# EasyEDA Pro project Aquarium_Temp_Monitor.eprj

# Schematic Schematic1
Board Name: Board1; Create Date: 2025-07-31; Page Name: P1; Project Name: Aquarium_Temp_Monitor; Schematic Name: Schematic1; Update Date: 2025-07-30; Company: EasyEDA.com; Page Size: A4; Version: V1.0
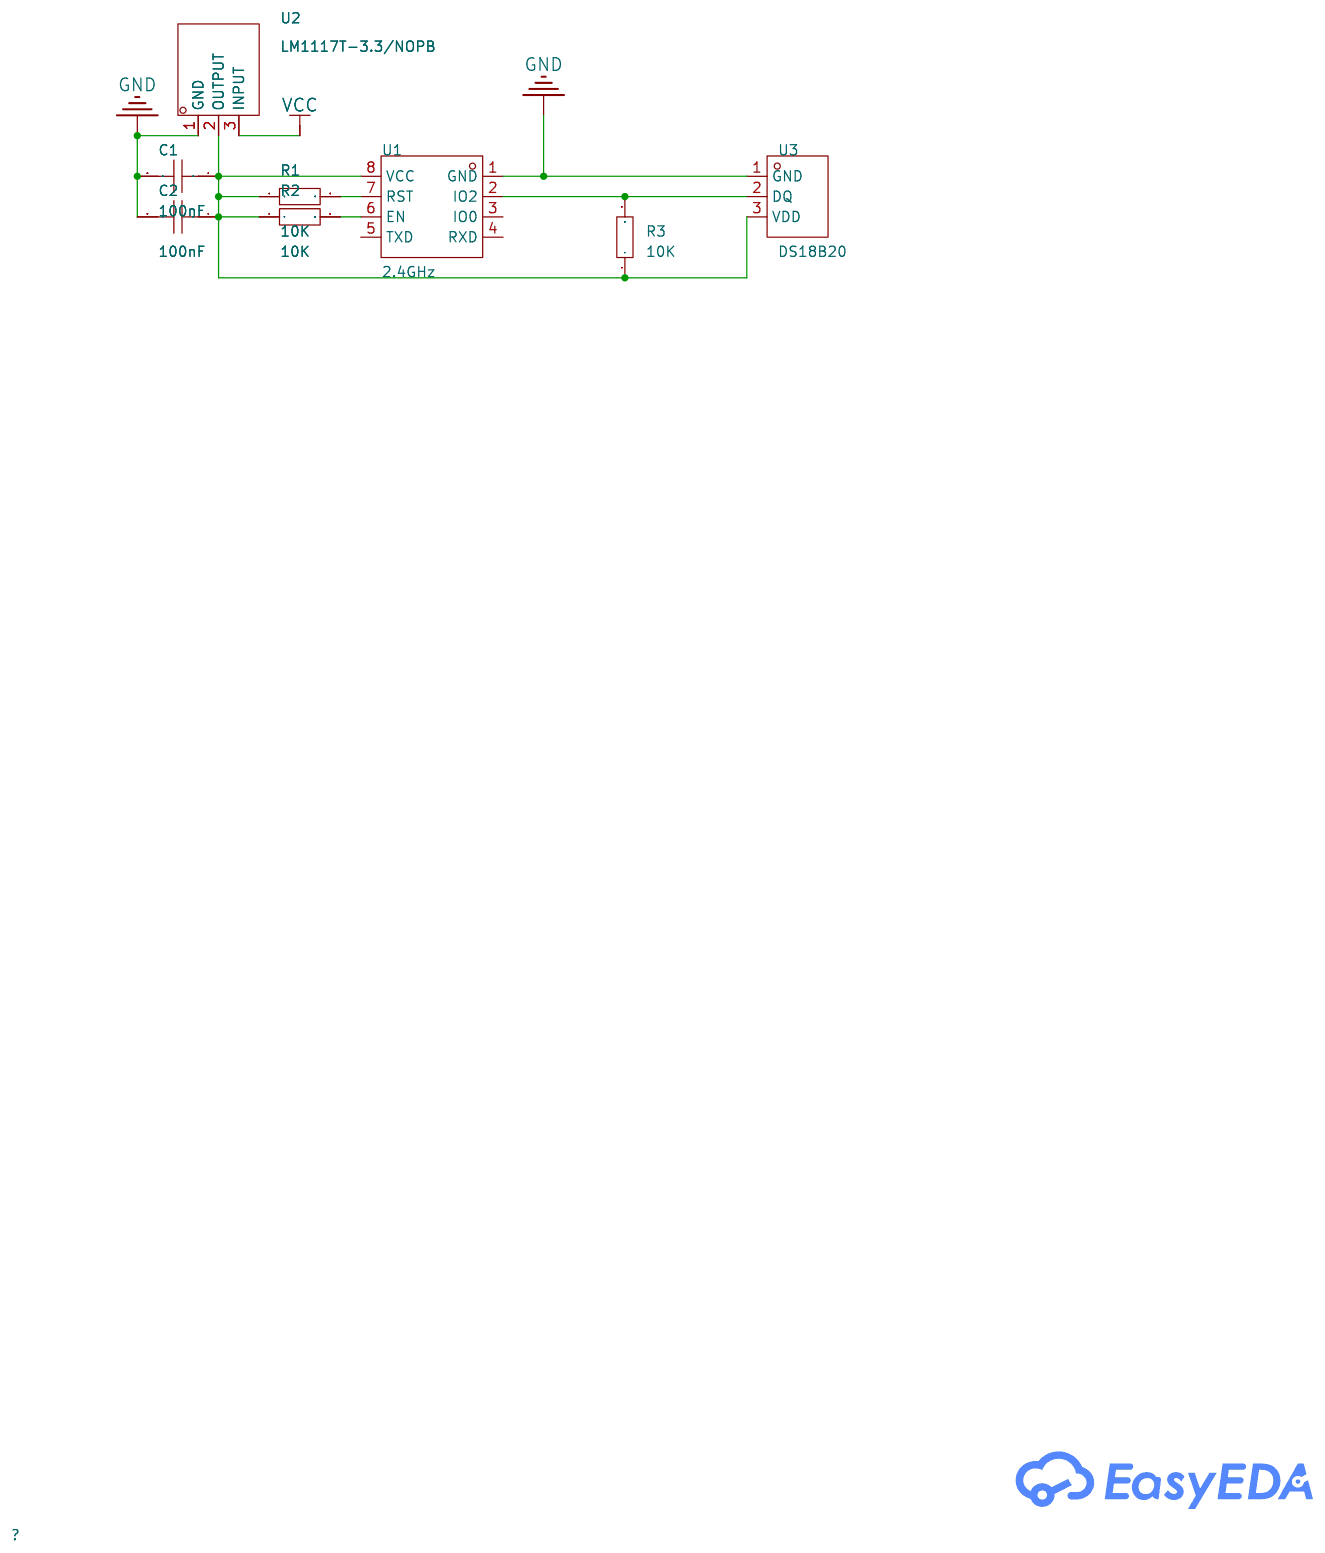
[diagram p0: schematic sheet]

## Parts
C1  100nF  [CAP-TH_L7.0-W4.5-P5.00-D0.5]
C2  100nF  [CAP-TH_L7.0-W4.5-P5.00-D0.5]
R1  10K  [RES-TH_BD2.0-L4.2-P8.20-D0.5]
R2  10K  [RES-TH_BD2.0-L4.2-P8.20-D0.5]
R3  10K  [RES-TH_BD2.0-L4.2-P8.20-D0.5]
U1  2.4GHz  [WIFIM-TH_8P-L24.7-W14.4-P2.54]
U2  LM1117T-3.3/NOPB  [TO-220-3_L10.0-W4.5-P2.54-L]
U3  DS18B20  [TO-92-3_L4.5-W3.5-P1.27-L]

## Library data of the parts
C1 C2 = CAP_0603: Supplier Footprint: 0603
R1-R3 = Res_0603: Supplier Footprint: 0603
U1 = ESP-01: LCSC Part Name: 体积超小的802.11b/g/nWi-FiSOC模块; Supplier Part: C503581; Manufacturer: Ai-Thinker(安信可); JLCPCB Part Class: Extended Part; Datasheet: https://atta.szlcsc.com/upload/public/pdf/source/20200407/C503581_BFDAA19F4B592DB0CEE4D61B6918C625.pdf; Supplier: LCSC; Utilized IC / Part: ESP8266 chip; Wireless Standard: 802.11b/g/n; Interface Type: UART; Output Power: 16dBm; Voltage - Supply: 3V~3.6V; Receive  Current: 20mA; Send  Current: 300mA; Sensitivity: -90dBm; Operating Temperature: -20℃~+85℃
U2 = LM1117T-3.3/NOPB: LCSC Part Name: 输入15V 输出3.3V 800mA; Supplier Part: C201726; Manufacturer: TI(德州仪器); Supplier Footprint: TO-220; JLCPCB Part Class: Extended Part; Datasheet: https://www.ti.com/cn/lit/gpn/lm1117; Supplier: LCSC; Maximum Input Voltage: 15V; Output Voltage: 3.3V; MAX Output Current: 800mA; Power Supply Rejection Ratio (PSRR): 75dB@(120Hz); Dropout Voltage: 1.2V@(800mA); standby current: 5mA; Operating Temperature: 0℃~+125℃; Output Polarity: Positive electrode; Number of Outputs: 1
U3 = DS18B20_C5451632: LCSC Part Name: 温度-10℃~70℃ 精度±0.4℃ 电压2.5V~5.5V; Supplier Part: C5451632; Manufacturer: HXY MOSFET(华轩阳电子); Supplier Footprint: TO-92; JLCPCB Part Class: Extended Part; Datasheet: https://atta.szlcsc.com/upload/public/pdf/source/20230427/F43BF9FBC8AD29BCFCC811AFA154CBDD.pdf; Supplier: LCSC; Tolerance: ±0.4℃; Voltage - Supply: 2.5V~5.5V

## Nets
GND: C1.2 C2.2 U1.1(GND) U2.1(GND) U3.1(GND)
VCC: U2.3(INPUT)
$1N378: C1.1 C2.1 R1.1 R2.1 R3.1 U1.8(VCC) U2.2(OUTPUT) U3.3(VDD)
$1N473: R3.2 U1.2(IO2) U3.2(DQ)
$1N565: R2.2 U1.6(EN)
$1N569: R1.2 U1.7(RST)

Not connected (* = marked no-connect by the designer): U1 3(IO0) 4(RXD) 5(TXD)

# Schematic Schematic1_1
Board Name: Board1_1; Create Date: 2025-07-31; Page Name: P1; Project Name: Aquarium_Temp_Monitor; Schematic Name: Schematic1_1; Update Date: 2025-07-31; Company: EasyEDA.com; Page Size: A4; Version: V1.0
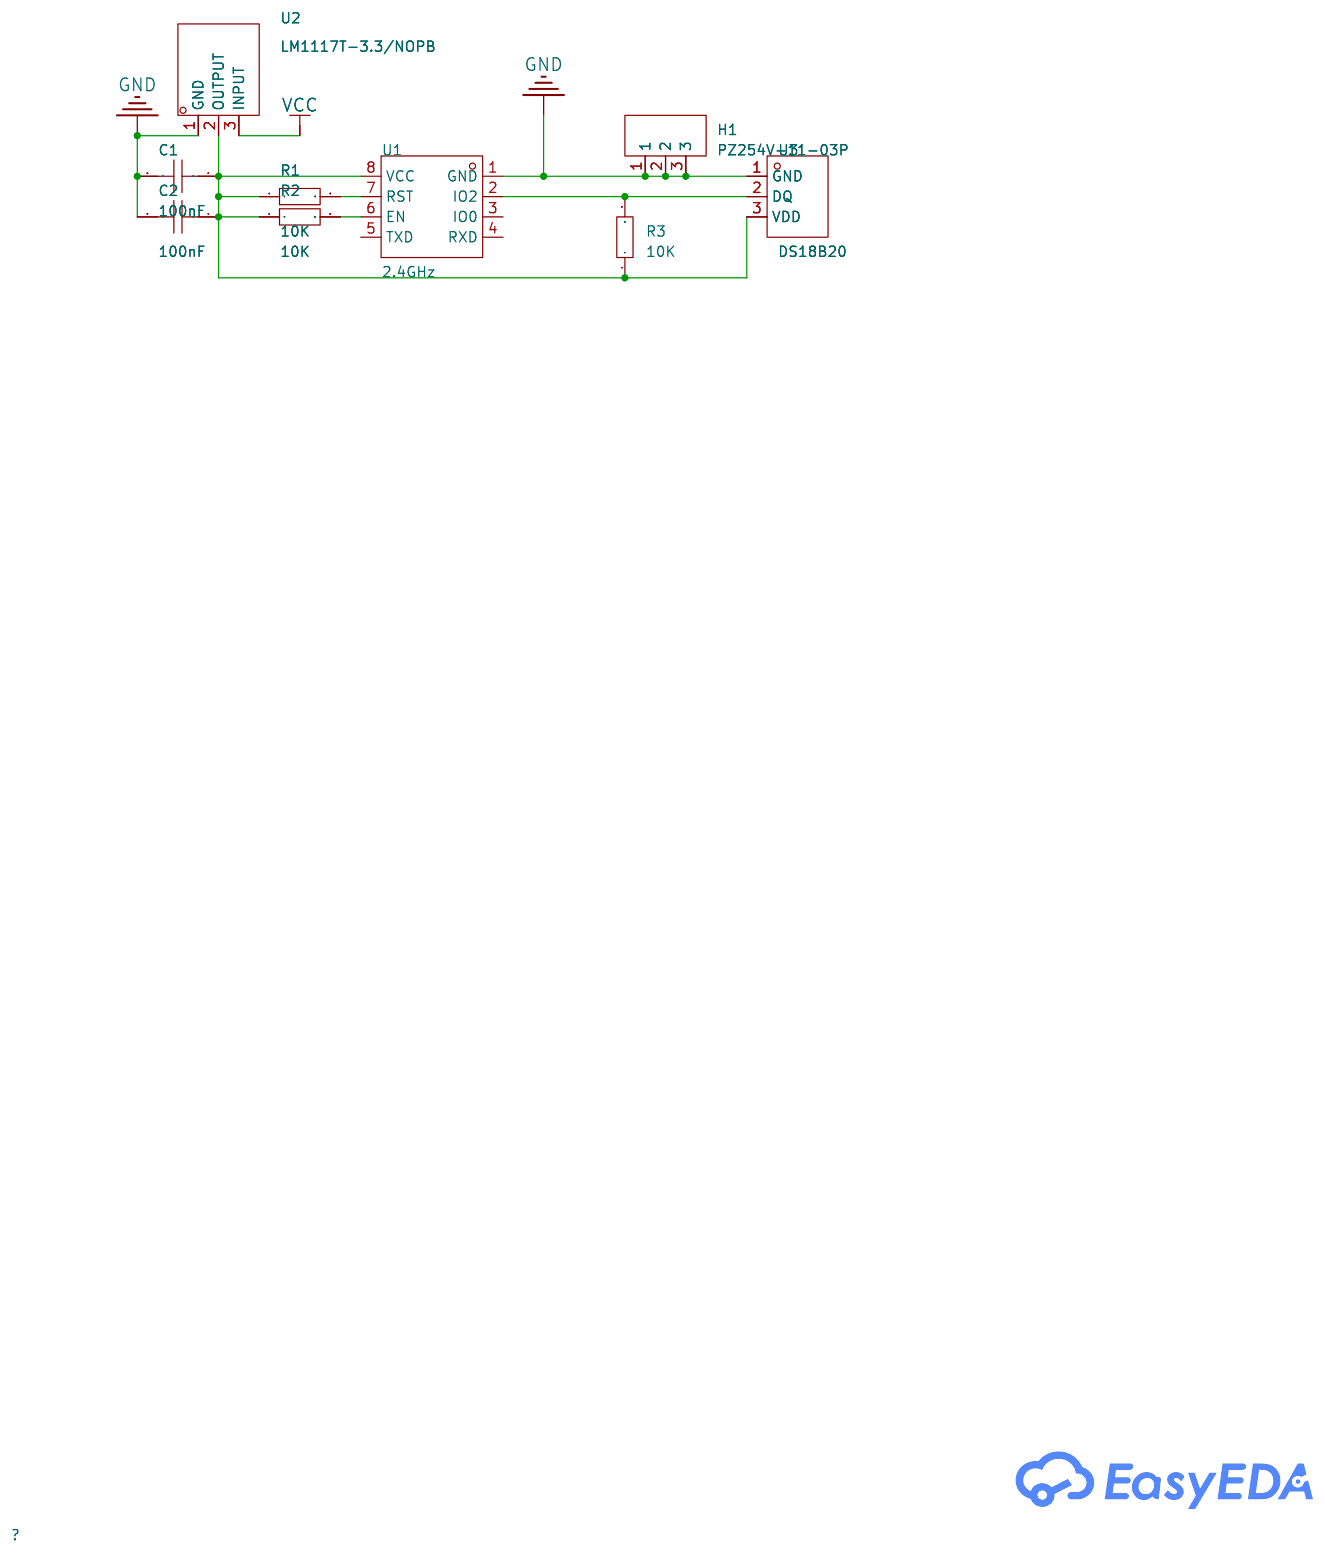
[diagram p1: schematic sheet]

## Parts
C1  100nF  [CAP-TH_L7.0-W4.5-P5.00-D0.5]
C2  100nF  [CAP-TH_L7.0-W4.5-P5.00-D0.5]
H1  PZ254V-11-03P  [HDR-TH_3P-P2.54-V-M]
R1  10K  [RES-TH_BD2.0-L4.2-P8.20-D0.5]
R2  10K  [RES-TH_BD2.0-L4.2-P8.20-D0.5]
R3  10K  [RES-TH_BD2.0-L4.2-P8.20-D0.5]
U1  2.4GHz  [WIFIM-TH_8P-L24.7-W14.4-P2.54]
U2  LM1117T-3.3/NOPB  [TO-220-3_L10.0-W4.5-P2.54-L]
U3  DS18B20  [TO-92-3_L4.5-W3.5-P1.27-L]

## Library data of the parts
C1 C2 = CAP_0603: Supplier Footprint: 0603
H1 = PZ254V-11-03P: LCSC Part Name: 1x3P 间距:2.54mm 方针 直插; Supplier Part: C2937625; Manufacturer: XFCN(兴飞); Supplier Footprint: 插件,P=2.54mm; JLCPCB Part Class: Extended Part; Datasheet: https://atta.szlcsc.com/upload/public/pdf/source/20200309/C492402_8335C3D49C4E4C618838D59BB1D024C1.pdf; Supplier: LCSC; Pin Structure: 1x3P; Pitch: 2.54mm; Circluar Pins/Square Pins: Policy; Mounting Type: Straight; Number of Rows: Single Row; Number of Pins: 3P; Current Rating: 3A; Voltage Rating (Max): 250V; Length of Mating Pin: 6mm; Insulation Height: 2.5mm; Length of End Connection Pin: 3mm; Operating Temperature: -40℃~+105℃; Color: Black
R1-R3 = Res_0603: Supplier Footprint: 0603
U1 = ESP-01: LCSC Part Name: 体积超小的802.11b/g/nWi-FiSOC模块; Supplier Part: C503581; Manufacturer: Ai-Thinker(安信可); JLCPCB Part Class: Extended Part; Datasheet: https://atta.szlcsc.com/upload/public/pdf/source/20200407/C503581_BFDAA19F4B592DB0CEE4D61B6918C625.pdf; Supplier: LCSC; Utilized IC / Part: ESP8266 chip; Wireless Standard: 802.11b/g/n; Interface Type: UART; Output Power: 16dBm; Voltage - Supply: 3V~3.6V; Receive  Current: 20mA; Send  Current: 300mA; Sensitivity: -90dBm; Operating Temperature: -20℃~+85℃
U2 = LM1117T-3.3/NOPB: LCSC Part Name: 输入15V 输出3.3V 800mA; Supplier Part: C201726; Manufacturer: TI(德州仪器); Supplier Footprint: TO-220; JLCPCB Part Class: Extended Part; Datasheet: https://www.ti.com/cn/lit/gpn/lm1117; Supplier: LCSC; Maximum Input Voltage: 15V; Output Voltage: 3.3V; MAX Output Current: 800mA; Power Supply Rejection Ratio (PSRR): 75dB@(120Hz); Dropout Voltage: 1.2V@(800mA); standby current: 5mA; Operating Temperature: 0℃~+125℃; Output Polarity: Positive electrode; Number of Outputs: 1
U3 = DS18B20_C5451632: LCSC Part Name: 温度-10℃~70℃ 精度±0.4℃ 电压2.5V~5.5V; Supplier Part: C5451632; Manufacturer: HXY MOSFET(华轩阳电子); Supplier Footprint: TO-92; JLCPCB Part Class: Extended Part; Datasheet: https://atta.szlcsc.com/upload/public/pdf/source/20230427/F43BF9FBC8AD29BCFCC811AFA154CBDD.pdf; Supplier: LCSC; Tolerance: ±0.4℃; Voltage - Supply: 2.5V~5.5V

## Nets
GND: C1.2 C2.2 H1.1 H1.2 H1.3 U1.1(GND) U2.1(GND) U3.1(GND)
VCC: U2.3(INPUT)
$1N565: R2.2 U1.6(EN)
$1N569: R1.2 U1.7(RST)
Net-(C1-1): C1.1 C2.1 R1.1 R2.1 R3.1 U1.8(VCC) U2.2(OUTPUT) U3.3(VDD)
Net-(R3-2): R3.2 U1.2(IO2) U3.2(DQ)

Not connected (* = marked no-connect by the designer): U1 3(IO0) 4(RXD) 5(TXD)

# Schematic Schematic1_2
Board Name: Rev2; Create Date: 2025-09-06; Page Name: P1; Project Name: Aquarium_Temp_Monitor; Schematic Name: Schematic1_2; Update Date: 2025-09-08; Company: EasyEDA.com; Page Size: A4; Version: V1.0
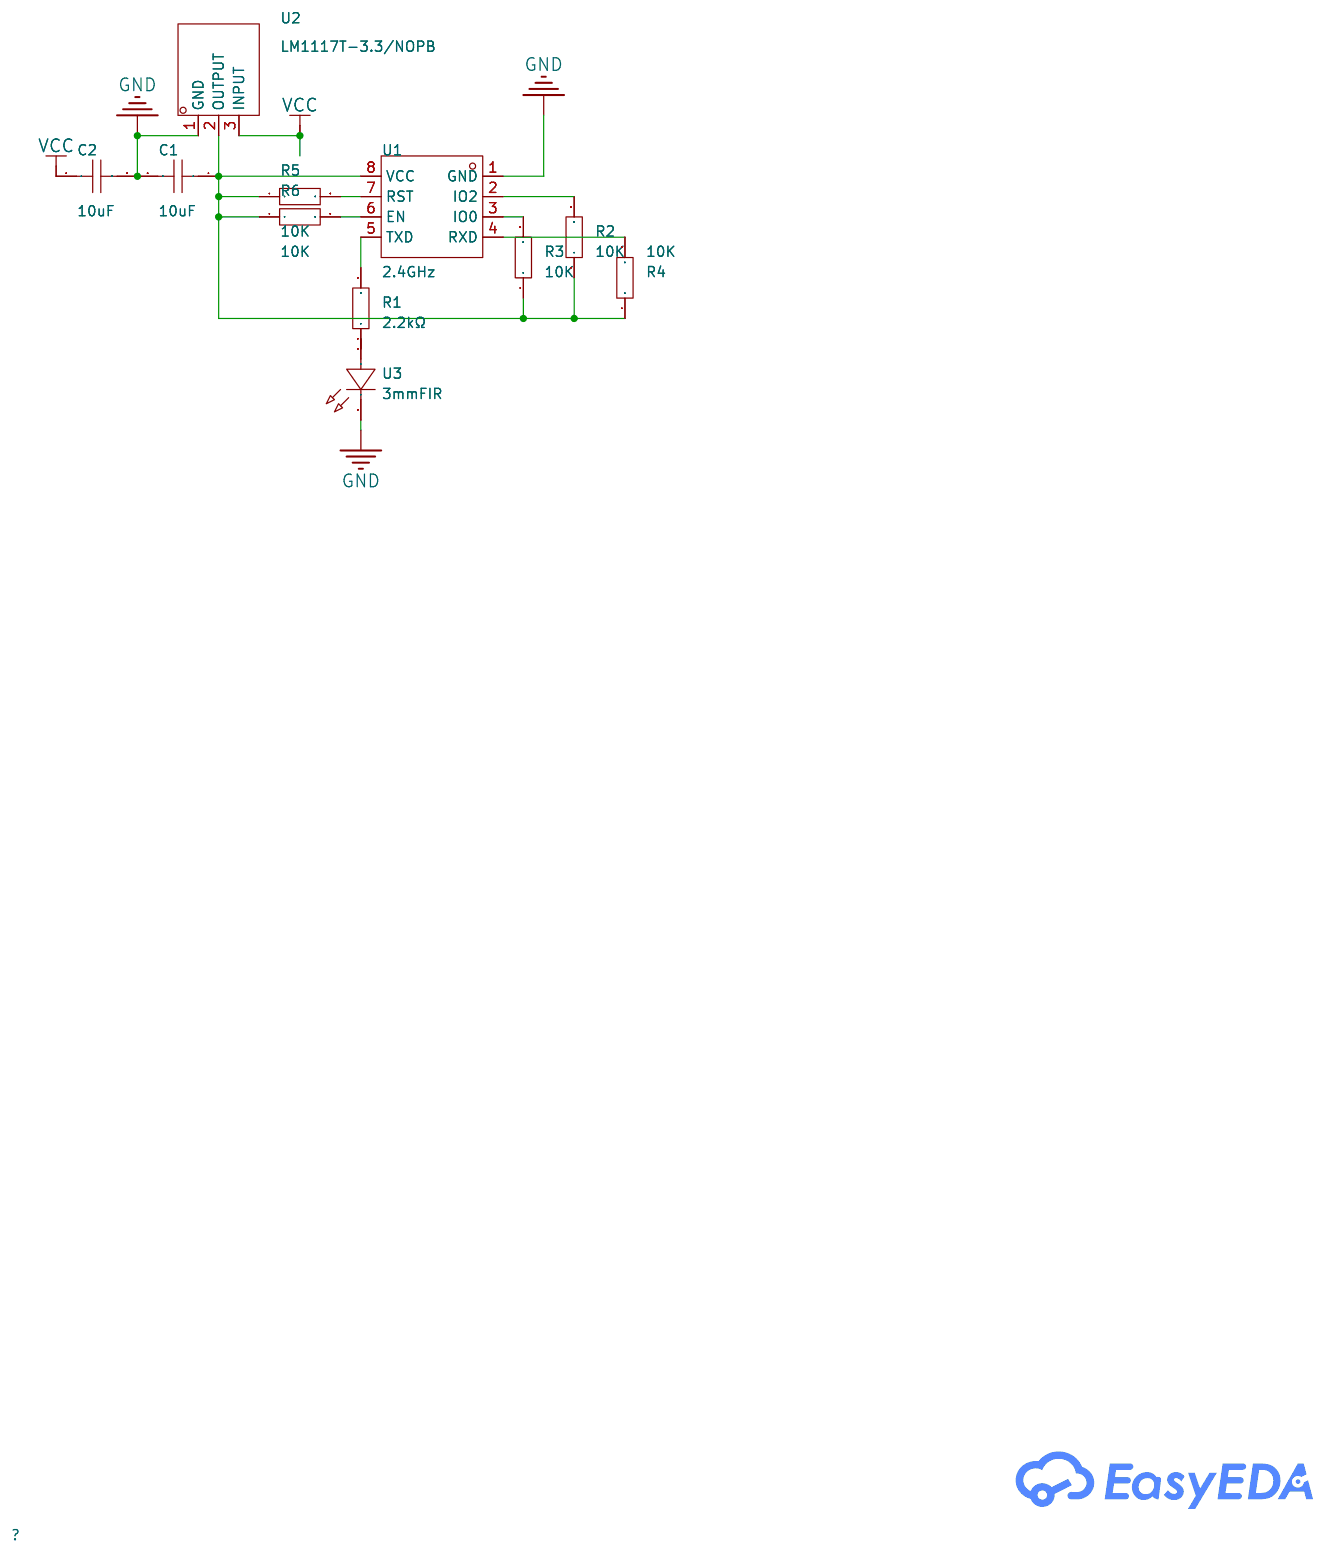
[diagram p2: schematic sheet]

## Parts
C1  10uF  [CAP-TH_BD5.0-P2.00-D0.8-FD]
C2  10uF  [CAP-TH_BD5.0-P2.00-D0.8-FD]
R1  2.2kΩ  [RES-TH_BD2.0-L4.2-P8.20-D0.5]
R2  10K  [RES-TH_BD2.0-L4.2-P8.20-D0.5]
R3  10K  [RES-TH_BD2.0-L4.2-P8.20-D0.5]
R4  10K  [RES-TH_BD2.0-L4.2-P8.20-D0.5]
R5  10K  [RES-TH_BD2.0-L4.2-P8.20-D0.5]
R6  10K  [RES-TH_BD2.0-L4.2-P8.20-D0.5]
U1  2.4GHz  [WIFIM-TH_8P-L24.7-W14.4-P2.54]
U2  LM1117T-3.3/NOPB  [TO-220-3_L10.0-W4.5-P2.54-L]
U3  3mmFIR  [LED-TH_BD3.0-P2.54-FD]

## Library data of the parts
C1 C2 = 01EC1777: LCSC Part Name: 10uF ±20% 25V; Supplier Part: C2833297; Manufacturer: KNSCHA(科尼盛); Supplier Footprint: 插件,D5xL11mm; JLCPCB Part Class: Extended Part; Datasheet: https://item.szlcsc.com/datasheet/01EC1777/2993432.html; Supplier: LCSC; Tolerance: ±20%; Voltage Rating: 25V; Ripple Current: 82mA@100kHz; Equivalent Series Resistance(ESR): 1Ω@100kHz; Pin Spacing: 2mm; Diameter: 5mm; Height - Seated (Max): 11mm; Lifetime: 2000hrs@105℃; Operating Temperature: -40℃~+105℃
R1 = MF0204FTE52-2K2: LCSC Part Name: 金属膜电阻 2.2kΩ ±1% 400mW; Supplier Part: C20611863; Manufacturer: YAGEO(国巨); Supplier Footprint: 插件,D1.9xL3.4mm; JLCPCB Part Class: Extended Part; Datasheet: https://item.szlcsc.com/datasheet/MF0204FTE52-2K2/21968348.html; Supplier: LCSC; Type: Metal Film Resistor; Tolerance: ±1%; Power(Watts): 400mW; Temperature Coefficient: ±50ppm/℃
R2-R6 = Res_0603: Supplier Footprint: 0603
U1 = ESP-01: LCSC Part Name: 体积超小的802.11b/g/nWi-FiSOC模块; Supplier Part: C503581; Manufacturer: Ai-Thinker(安信可); JLCPCB Part Class: Extended Part; Datasheet: https://atta.szlcsc.com/upload/public/pdf/source/20200407/C503581_BFDAA19F4B592DB0CEE4D61B6918C625.pdf; Supplier: LCSC; Utilized IC / Part: ESP8266 chip; Wireless Standard: 802.11b/g/n; Interface Type: UART; Output Power: 16dBm; Voltage - Supply: 3V~3.6V; Receive  Current: 20mA; Send  Current: 300mA; Sensitivity: -90dBm; Operating Temperature: -20℃~+85℃
U2 = LM1117T-3.3/NOPB: LCSC Part Name: 输入15V 输出3.3V 800mA; Supplier Part: C201726; Manufacturer: TI(德州仪器); Supplier Footprint: TO-220; JLCPCB Part Class: Extended Part; Datasheet: https://www.ti.com/cn/lit/gpn/lm1117; Supplier: LCSC; Maximum Input Voltage: 15V; Output Voltage: 3.3V; MAX Output Current: 800mA; Power Supply Rejection Ratio (PSRR): 75dB@(120Hz); Dropout Voltage: 1.2V@(800mA); standby current: 5mA; Operating Temperature: 0℃~+125℃; Output Polarity: Positive electrode; Number of Outputs: 1
U3 = 3mmFIR: Supplier Part: C9900095018; Supplier Footprint: LED-TH_LED-3MM_RED; JLCPCB Part Class: Extended Part; Supplier: LCSC

## Nets
GND: C1.2 C2.2 U1.1(GND) U2.1(GND) U3.2(K)
VCC: C2.1 U2.3(INPUT)
$1N378: C1.1 R2.1 R3.1 R4.1 R5.1 R6.1 U1.8(VCC) U2.2(OUTPUT)
$1N473: R4.2 U1.4(RXD)
$1N565: R6.2 U1.6(EN)
$1N569: R5.2 U1.7(RST)
$1N1882: R3.2 U1.3(IO0)
$1N1886: R2.2 U1.2(IO2)
$1N1976: R1.2 U1.5(TXD)
$1N1978: R1.1 U3.1(A)

# Board PCB1
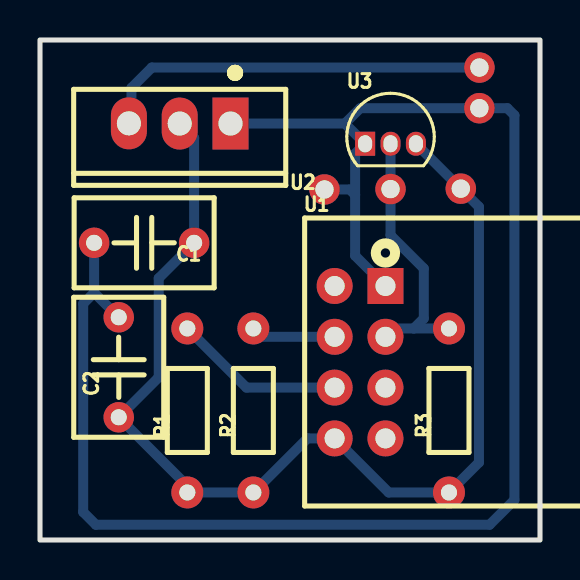
[diagram p3: board, top side]
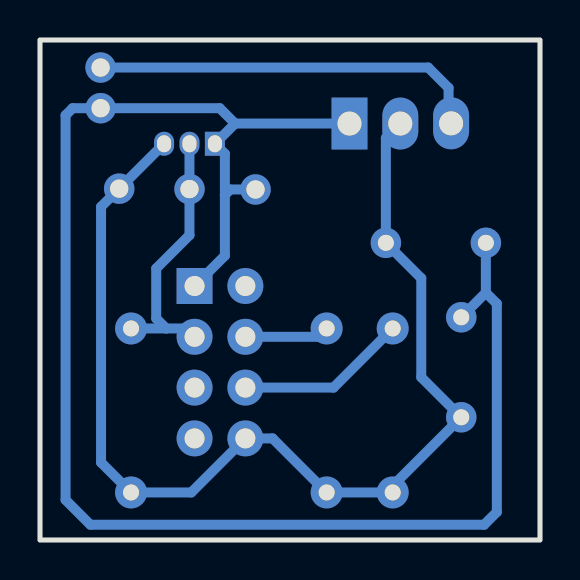
[diagram p4: board, bottom side, seen from below]

Outline 25 x 25 mm; copper layers: Top Layer, Bottom Layer. Coordinates in mm from the lower left corner of the outline.
Outline path: rectangle 0,25 25,0
Stack: Top Layer 0.035mm / Dielectric1 1.51mm FR4 er 4.5 / Bottom Layer 0.035mm

## Design rules (mm)
template: Custom Config
spacing copperThickness1oz (default): track to track 0.3, other pairs 0.152 to 0.3
spacing copperThickness2oz: track to track 0.203, other pairs 0.152 to 0.3
track width copperThickness1oz (default): min 0.127, default 0.5, max 2.54
track width copperThickness2oz: min 0.203, default 0.254, max 2.54
differential pair differentialPair (default): width min 0.127, default 0.254, max 2.54; gap min 0.152, default 0.152
via viaSize (default): diameter min 0.5, default 0.61, max 10; hole min 0.3, default 0.305, max 6.3

## Placement (name value [footprint] x y rotation side)
C1  100nF  [CAP-TH_L7.0-W4.5-P5.00-D0.5]  5.21 14.86 180 top
C2  100nF  [CAP-TH_L7.0-W4.5-P5.00-D0.5]  3.94 8.64 90 top
NOREF  -  [Pad_e55]  21.04 17.57 0 top
NOREF#2  -  [Pad_e48]  17.53 17.55 0 top
NOREF#3  -  [Pad_e24]  21.97 21.59 0 top
NOREF#4  -  [Pad_e46]  14.22 17.53 0 top
NOREF#5  -  [Pad_e23]  21.97 23.62 0 top
R1  10K  [RES-TH_BD2.0-L4.2-P8.20-D0.5]  7.37 6.48 90 top
R2  10K  [RES-TH_BD2.0-L4.2-P8.20-D0.5]  10.67 6.48 90 top
R3  10K  [RES-TH_BD2.0-L4.2-P8.20-D0.5]  20.45 6.48 90 top
U1  2.4GHz  [WIFIM-TH_8P-L24.7-W14.4-P2.54]  16 8.89 0 top
U2  LM1117T-3.3/NOPB  [TO-220-3_L10.0-W4.5-P2.54-L]  6.99 20.83 180 top
U3  DS18B20  [TO-92-3_L4.5-W3.5-P1.27-L]  17.53 19.81 0 top

## Footprints (pads in the part's own frame, mm; a bottom-side part is the same pattern mirrored in y, then rotated)
CAP-TH_L7.0-W4.5-P5.00-D0.5
  round 1.524 hole 0.8: 1(-2.5,0) 2(2.5,0)
Pad_e23
  round 1.524 hole 0.914: 1(0,0)
Pad_e24
  round 1.524 hole 0.914: 2(0,0)
Pad_e46
  round 1.524 hole 0.914: 1(0,0)
Pad_e48
  round 1.524 hole 0.914: 1(0,0)
Pad_e55
  round 1.524 hole 0.914: 1(0,0)
RES-TH_BD2.0-L4.2-P8.20-D0.5
  round 1.6 hole 0.8: 1(-4.1,0) 2(4.1,0)
TO-92-3_L4.5-W3.5-P1.27-L
  rect 1x1.2 hole 0.7x0.85: 1(-1.27,0)
  oval 1x1.2 hole 0.7x0.85: 2(0,0) 3(1.27,0)
TO-220-3_L10.0-W4.5-P2.54-L
  rect 1.8x2.6 hole 1.2: 1(-2.54,0.005)
  oval 1.8x2.6 hole 1.2: 2(0,0.005) 3(2.54,-0.005)
WIFIM-TH_8P-L24.7-W14.4-P2.54
  rect 1.8x1.8 hole 1: 1(1.27,3.81)
  round 1.8 hole 1: 2(1.27,1.27) 3(1.27,-1.27) 4(1.27,-3.81) 5(-1.27,3.81) 6(-1.27,1.27) 7(-1.27,-1.27) 8(-1.27,-3.81)

## Nets
GND: C1.2 C2.2 NOREF#3.2 NOREF#4.1 U1.1 U2.1 U3.1
VCC: NOREF#5.1 U2.3
$1N378: C1.1 C2.1 NOREF.1 R1.1 R2.1 R3.1 U1.8 U2.2 U3.3
$1N473: NOREF#2.1 R3.2 U1.2 U3.2
$1N565: R2.2 U1.6
$1N569: R1.2 U1.7

Pads without a net: U1 3 4 5

## Via types
v1: diameter 0.61, hole 0.305, Top Layer to Bottom Layer, 1 via

## Routing (per net, layer and track width the routed paths; a pad name or vN(x,y) marks a point on that pad's centre or on a via; arc(x,y) is an arc through that point)
GND: length 82.7
  Bottom Layer w0.5: 15.76,17.26 15.76,19.31 U3.1 15.25,20.82 ; 15.76,17.26 15.49,17.53 v1(14.22,17.53) ; 15.76,17.26 15.76,14.22 U1.1 ; U2.1 15.25,20.82 ; 15.25,20.82 16.01,21.59 NOREF#3.2 23.37,21.59 23.72,21.24 23.72,2 22.48,0.76 2.79,0.76 2.16,1.4 2.16,11.82 2.71,12.37 ; 2.71,12.37 C2.2 ; 2.71,12.37 C1.2
VCC: length 19.6
  Bottom Layer w0.5: NOREF#5.1 5.59,23.62 4.57,22.61 4.57,20.96 4.44,20.83
$1N378: length 56.4
  Bottom Layer w0.5: U2.2 7.71,20.1 C1.1 5.94,13.09 5.94,8.14 C2.1 7.37,2.71 7.37,2.38 10.67,2.38 13.37,5.08 U1.8 17.44,2.38 20.45,2.38 21.95,3.88 21.95,16.66 NOREF.1 U3.3
$1N473: length 13.5
  Bottom Layer w0.5: 18.69,10.58 19.19,11.08 19.19,13.58 17.53,15.24 NOREF#2.1 U3.2 ; 18.69,10.58 17.69,10.58 U1.2 ; 18.69,10.58 R3.2
$1N565: length 4.2
  Bottom Layer w0.5: U1.6 11.09,10.16 R2.2
$1N569: length 8.6
  Bottom Layer w0.5: R1.2 10.32,7.62 U1.7

# Board PCB1_1
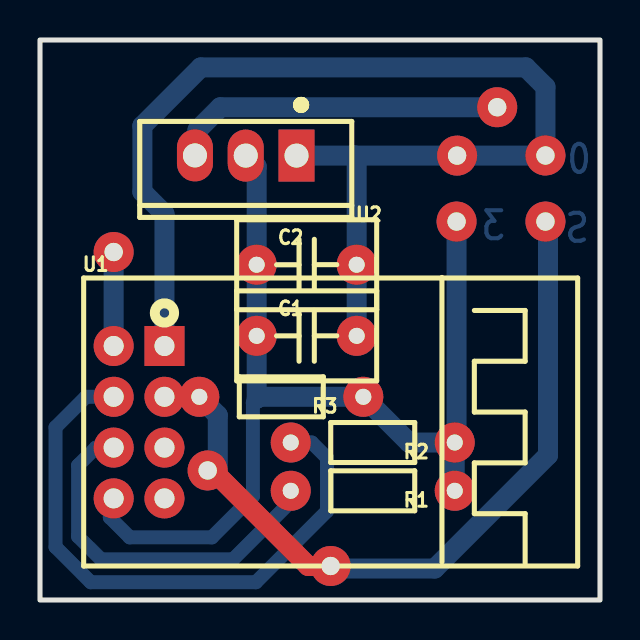
[diagram p5: board, top side]
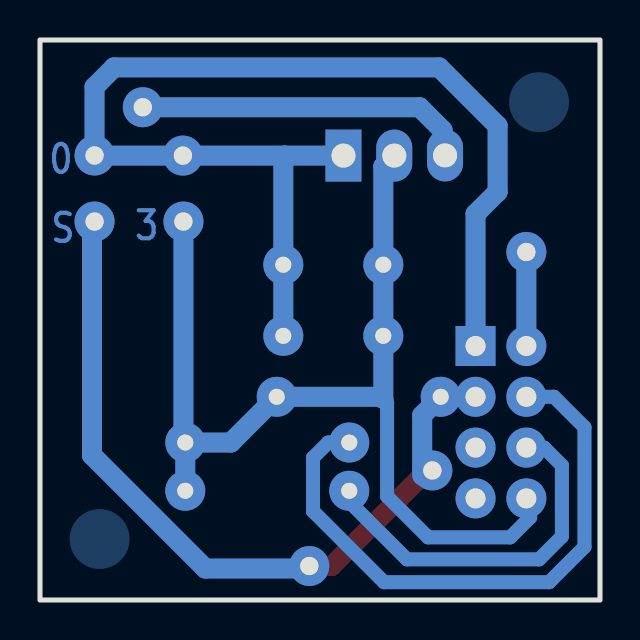
[diagram p6: board, bottom side, seen from below]

Outline 28 x 28 mm; copper layers: Top Layer, Bottom Layer. Coordinates in mm from the lower left corner of the outline.
Outline path: rectangle 0,28 28,0
Stack: Top Layer 0.035mm / Dielectric1 1.51mm FR4 er 4.5 / Bottom Layer 0.035mm

## Design rules (mm)
template: Custom Config
spacing copperThickness1oz (default): track to track 0.4, other pairs 0.152 to 0.4
spacing copperThickness2oz: track to track 0.203, other pairs 0.152 to 0.3
track width copperThickness1oz (default): min 0.127, default 1, max 2.54
track width copperThickness2oz: min 0.203, default 0.254, max 2.54
differential pair differentialPair (default): width min 0.127, default 0.254, max 2.54; gap min 0.152, default 0.152
via viaSize (default): diameter min 0.5, default 0.61, max 10; hole min 0.3, default 0.305, max 6.3

## Placement (name value [footprint] x y rotation side)
C1  100nF  [CAP-TH_L7.0-W4.5-P5.00-D0.5]  13.34 13.21 0 top
C2  100nF  [CAP-TH_L7.0-W4.5-P5.00-D0.5]  13.34 16.76 0 top
NOREF  -  [Pad_e149]  8.38 6.48 0 top
NOREF#2  -  [Pad_e55]  20.83 18.92 0 top
NOREF#3  -  [Pad_e211]  14.53 1.7 0 top
NOREF#4  -  [Pad_e226]  25.27 18.92 0 top
NOREF#5  -  [Pad_e24]  25.27 22.22 0 top
NOREF#6  -  [Pad_e23]  22.86 24.64 0 top
NOREF#7  -  [Pad_e219]  20.85 22.22 0 top
NOREF#8  -  [Pad_e526]  3.68 17.4 0 top
R1  10K  [RES-TH_BD2.0-L4.2-P8.20-D0.5]  16.64 5.46 180 top
R2  10K  [RES-TH_BD2.0-L4.2-P8.20-D0.5]  16.64 7.87 180 top
R3  10K  [RES-TH_BD2.0-L4.2-P8.20-D0.5]  12.06 10.16 180 top
U1  2.4GHz  [WIFIM-TH_8P-L24.7-W14.4-P2.54]  4.95 8.89 0 top
U2  LM1117T-3.3/NOPB  [TO-220-3_L10.0-W4.5-P2.54-L]  10.29 22.22 180 top

## Footprints (pads in the part's own frame, mm; a bottom-side part is the same pattern mirrored in y, then rotated)
CAP-TH_L7.0-W4.5-P5.00-D0.5
  round 2 hole 0.8: 1(-2.5,0) 2(2.5,0)
Pad_e23
  round 2 hole 0.914: 1(0,0)
Pad_e24
  round 2 hole 0.914: 2(0,0)
Pad_e55
  round 2 hole 0.914: 1(0,0)
Pad_e149
  round 2 hole 0.914: 1(0,0)
Pad_e211
  round 2 hole 0.914: 1(0,0)
Pad_e219
  round 2 hole 0.914: 2(0,0)
Pad_e226
  round 2 hole 0.914: 1(0,0)
Pad_e526
  round 2 hole 0.914: 2(0,0)
RES-TH_BD2.0-L4.2-P8.20-D0.5
  round 2 hole 0.8: 1(-4.1,0) 2(4.1,0)
TO-220-3_L10.0-W4.5-P2.54-L
  rect 1.8x2.6 hole 1.2: 1(-2.54,0.005)
  oval 1.8x2.6 hole 1.2: 2(0,0.005) 3(2.54,-0.005)
WIFIM-TH_8P-L24.7-W14.4-P2.54
  rect 2x2 hole 1: 1(1.27,3.81)
  round 2 hole 1: 2(1.27,1.27) 3(1.27,-1.27) 4(1.27,-3.81) 5(-1.27,3.81) 6(-1.27,1.27) 7(-1.27,-1.27) 8(-1.27,-3.81)

## Nets
GND: C1.2 C2.2 NOREF#5.2 NOREF#7.2 U1.1 U2.1
VCC: NOREF#6.1 U2.3
$1N378: C1.1 C2.1 NOREF#2.1 R1.1 R2.1 R3.1 U1.8 U2.2
$1N473: NOREF.1 NOREF#3.1 NOREF#4.1 R3.2 U1.2
$1N565: R2.2 U1.6
$1N569: R1.2 U1.7

Pads without a net: NOREF#8 2; U1 3 4 5

## Routing (per net, layer and track width the routed paths; a pad name or vN(x,y) marks a point on that pad's centre or on a via; arc(x,y) is an arc through that point)
GND: length 57.6
  Bottom Layer w1: U1.1 6.22,19.3 5.12,20.41 5.12,23.71 8.04,26.63 24.3,26.63 25.27,25.65 NOREF#5.2 25.27,22.22 NOREF#7.2 15.77,22.22 ; 15.84,13.72 15.84,22.16 15.77,22.22 ; U2.1 15.77,22.22
VCC: length 17
  Bottom Layer w1: 23.11,24.64 9.02,24.64 7.87,23.5 7.87,22.36 U2.3
(no net): length 4.7
  Bottom Layer w1: U1.5 NOREF#8.2
$1N378: length 50.8
  Bottom Layer w0.7: U1.8 3.49,4.89 3.49,4.13 4.49,3.13 8.59,3.13 10.64,5.18 10.64,9.87 10.84,10.06
  Bottom Layer w1: NOREF#2.1 20.83,7.97 R2.1 ; R2.1 20.74,5.84 ; R2.1 18.45,7.87 R3.1 10.93,10.16 10.84,10.06 10.84,21.67 U2.2
$1N473: length 38.6
  Top Layer w1: NOREF#3.1 13.41,1.7 8.89,6.22
  Bottom Layer w1: 8.89,6.22 8.89,9.23 R3.2 U1.2 ; NOREF#3.1 14.66,1.57 19.73,1.57 25.4,7.24 25.4,18.8 NOREF#4.1
$1N565: length 30.1
  Bottom Layer w0.7: R2.2 13.59,7.87 14.35,7.11 14.35,4.44 10.79,0.89 2.54,0.89 0.78,2.65 0.78,8.64 2.3,10.16 U1.6
$1N569: length 18.9
  Bottom Layer w0.7: 12.54,5.84 12.54,4.92 9.65,2.03 3.05,2.03 1.91,3.17 1.91,6.73 2.79,7.62 U1.7

## Copper pours and planes (outline as drawn; the poured copper is in the pictures)
(no net) on Bottom Layer: 1.55,26.39 4.54,26.39 4.54,23.4 1.55,23.4
(no net) on Bottom Layer: 23.52,4.54 26.51,4.54 26.51,1.55 23.52,1.55

## Text on the board
Bottom Layer: 3 | S | 0

# Board PCB1_2
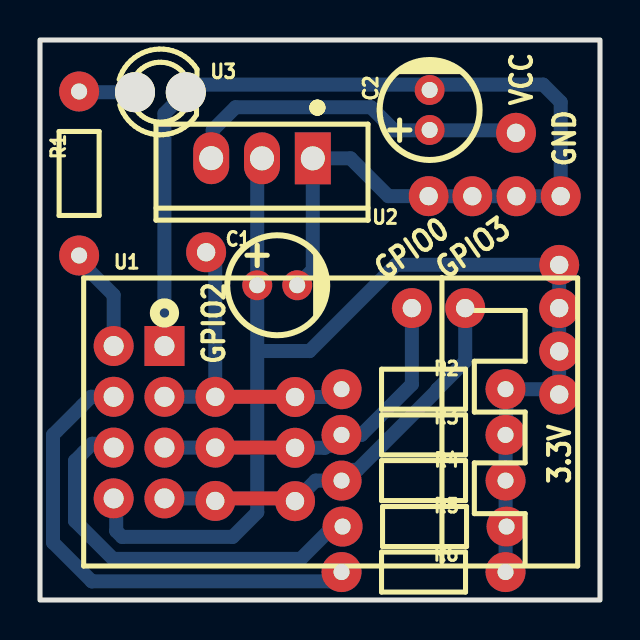
[diagram p7: board, top side]
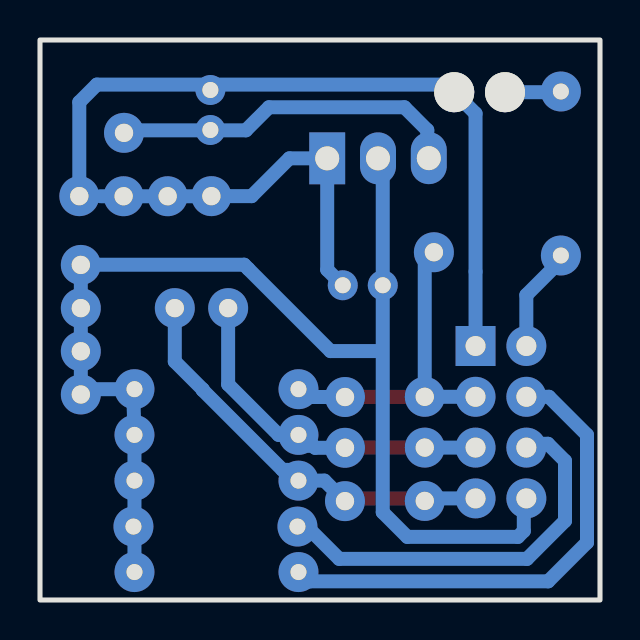
[diagram p8: board, bottom side, seen from below]

Outline 28 x 28 mm; copper layers: Top Layer, Bottom Layer. Coordinates in mm from the lower left corner of the outline.
Outline path: rectangle 0,28 28,0
Stack: Top Layer 0.035mm / Dielectric1 1.51mm FR4 er 4.5 / Bottom Layer 0.035mm

## Design rules (mm)
template: Custom Config
spacing copperThickness1oz (default): track to track 0.4, other pairs 0.152 to 0.4
spacing copperThickness2oz: track to track 0.203, other pairs 0.152 to 0.3
track width copperThickness1oz (default): min 0.127, default 1, max 2.54
track width copperThickness2oz: min 0.203, default 0.254, max 2.54
differential pair differentialPair (default): width min 0.127, default 0.254, max 2.54; gap min 0.152, default 0.152
via viaSize (default): diameter min 0.5, default 0.61, max 10; hole min 0.3, default 0.305, max 6.3

## Placement (name value [footprint] x y rotation side)
C1  10uF  [CAP-TH_BD5.0-P2.00-D0.8-FD]  11.86 15.74 0 top
C2  10uF  [CAP-TH_BD5.0-P2.00-D0.8-FD]  19.48 24.5 90 top
NOREF  -  [Pad_e608]  8.31 17.39 0 top
NOREF#2  -  [Pad_e55]  25.96 16.75 0 top
NOREF#3  -  [Pad_e295]  25.96 12.44 0 top
NOREF#4  -  [Pad_e486]  12.75 4.94 0 top
NOREF#5  -  [Pad_e306]  23.82 20.19 0 top
NOREF#6  -  [Pad_e23]  23.8 23.36 0 top
NOREF#7  -  [Pad_e606]  18.59 14.59 0 top
NOREF#8  -  [Pad_e204]  8.76 10.16 0 top
NOREF#9  -  [Pad_e219]  21.62 20.19 0 top
NOREF#10  -  [Pad_e484]  12.75 10.15 0 top
NOREF#11  -  [Pad_e24]  26.03 20.19 0 top
NOREF#12  -  [Pad_e218]  8.76 7.62 0 top
NOREF#13  -  [Pad_e226]  21.26 14.59 0 top
NOREF#14  -  [Pad_e222]  8.76 4.95 0 top
NOREF#15  -  [Pad_e303]  19.43 20.19 0 top
NOREF#16  -  [Pad_e485]  12.75 7.61 0 top
NOREF#17  -  [Pad_e294]  25.96 10.28 0 top
NOREF#18  -  [Pad_e296]  25.96 14.59 0 top
R1  2.2kΩ  [RES-TH_BD2.0-L4.2-P8.20-D0.5]  1.96 21.33 270 top
R2  10K  [RES-TH_BD2.0-L4.2-P8.20-D0.5]  19.18 10.54 180 top
R3  10K  [RES-TH_BD2.0-L4.2-P8.20-D0.5]  19.18 8.25 180 top
R4  10K  [RES-TH_BD2.0-L4.2-P8.20-D0.5]  19.18 5.97 180 top
R5  10K  [RES-TH_BD2.0-L4.2-P8.20-D0.5]  19.23 3.67 180 top
R6  10K  [RES-TH_BD2.0-L4.2-P8.20-D0.5]  19.18 1.4 180 top
U1  2.4GHz  [WIFIM-TH_8P-L24.7-W14.4-P2.54]  4.95 8.89 0 top
U2  LM1117T-3.3/NOPB  [TO-220-3_L10.0-W4.5-P2.54-L]  11.1 22.09 180 top
U3  3mmFIR  [LED-TH_BD3.0-P2.54-FD]  6.02 25.39 0 top

## Footprints (pads in the part's own frame, mm; a bottom-side part is the same pattern mirrored in y, then rotated)
CAP-TH_BD5.0-P2.00-D0.8-FD
  round 1.5 hole 0.8: 1(-1,0) 2(1,0)
LED-TH_BD3.0-P2.54-FD
  round 2 hole 2x1: 1(-1.27,0) 2(1.27,0)
Pad_e23
  round 2 hole 0.914: 1(0,0)
Pad_e24
  round 2 hole 0.914: 2(0,0)
Pad_e55
  round 2 hole 0.914: 1(0,0)
Pad_e204
  round 2 hole 0.914: 1(0,0)
Pad_e218
  round 2 hole 0.914: 1(0,0)
Pad_e219
  round 2 hole 0.914: 2(0,0)
Pad_e222
  round 2 hole 0.914: 2(0,0)
Pad_e226
  round 2 hole 0.914: 1(0,0)
Pad_e294
  round 2 hole 0.914: 1(0,0)
Pad_e295
  round 2 hole 0.914: 1(0,0)
Pad_e296
  round 2 hole 0.914: 1(0,0)
Pad_e303
  round 2 hole 0.914: 2(0,0)
Pad_e306
  round 2 hole 0.914: 2(0,0)
Pad_e484
  round 2 hole 0.914: 1(0,0)
Pad_e485
  round 2 hole 0.914: 1(0,0)
Pad_e486
  round 2 hole 0.914: 2(0,0)
Pad_e606
  round 2 hole 0.914: 1(0,0)
Pad_e608
  round 2 hole 0.914: 1(0,0)
RES-TH_BD2.0-L4.2-P8.20-D0.5
  round 2 hole 0.8: 1(-4.1,0) 2(4.1,0)
TO-220-3_L10.0-W4.5-P2.54-L
  rect 1.8x2.6 hole 1.2: 1(-2.54,0.005)
  oval 1.8x2.6 hole 1.2: 2(0,0.005) 3(2.54,-0.005)
WIFIM-TH_8P-L24.7-W14.4-P2.54
  rect 2x2 hole 1: 1(1.27,3.81)
  round 2 hole 1: 2(1.27,1.27) 3(1.27,-1.27) 4(1.27,-3.81) 5(-1.27,3.81) 6(-1.27,1.27) 7(-1.27,-1.27) 8(-1.27,-3.81)

## Nets
GND: C1.2 C2.2 NOREF#5.2 NOREF#9.2 NOREF#11.2 NOREF#15.2 U1.1 U2.1 U3.2
VCC: C2.1 NOREF#6.1 U2.3
$1N378: C1.1 NOREF#2.1 NOREF#3.1 NOREF#17.1 NOREF#18.1 R2.1 R3.1 R4.1 R5.1 R6.1 U1.8 U2.2
$1N473: NOREF#4.2 NOREF#13.1 NOREF#14.2 R4.2 U1.4
$1N565: R6.2 U1.6
$1N569: R5.2 U1.7
$1N1882: NOREF#7.1 NOREF#12.1 NOREF#16.1 R3.2 U1.3
$1N1886: NOREF.1 NOREF#8.1 NOREF#10.1 R2.2 U1.2
$1N1976: R1.2 U1.5
$1N1978: R1.1 U3.1

## Routing (per net, layer and track width the routed paths; a pad name or vN(x,y) marks a point on that pad's centre or on a via; arc(x,y) is an arc through that point)
GND: length 56.1
  Bottom Layer w0.7: C2.2 19.48,25.77 ; 19.48,25.77 25.16,25.77 26.03,24.89 NOREF#11.2 ; 19.48,25.77 7.93,25.77 7.42,25.26 ; 19.43,20.19 NOREF#9.2 NOREF#5.2 24.97,20.19 ; U3.2 6.22,24.32 U1.1 ; C1.2 13.64,16.52 U2.1 15.53,22.08 17.42,20.19 NOREF#15.2
VCC: length 17.5
  Bottom Layer w0.7: 8.51,22.23 8.64,22.36 8.64,23.5 9.78,24.64 16.55,24.64 17.7,23.48 23.67,23.48 NOREF#6.1
$1N378: length 61.4
  Bottom Layer w0.7: 11.23,12.45 13.47,12.45 17.79,16.76 25.95,16.76 ; 23.28,1.52 R4.1 23.28,8.38 23.35,10.54 ; NOREF#18.1 NOREF#3.1 NOREF#17.1 25.69,10.54 R2.1 ; 10.86,21.67 C1.1 10.86,4.39 9.63,3.16 4.11,3.16 3.81,3.45 3.81,4.95 U1.8 ; 25.96,14.67 NOREF#2.1
  Bottom Layer w1: NOREF#2.1 25.95,16.76
$1N473: length 21.1
  Top Layer w0.7: NOREF#14.2 8.89,5.08 13.08,5.08
  Bottom Layer w0.7: U1.4 8.64,5.08 NOREF#14.2 ; NOREF#13.1 21.26,11.93 19.86,10.53 19.86,10.5 15.87,6.5 15.61,6.5 R4.2 13.78,5.97 NOREF#4.2
$1N565: length 24.7
  Bottom Layer w0.7: 15.08,1.52 14.49,0.93 2.59,0.93 0.65,2.87 0.65,8.26 2.55,10.16 U1.6
$1N569: length 20.2
  Bottom Layer w0.7: R5.2 14.66,3.67 13.04,2.06 3.65,2.06 1.75,3.96 1.75,6.96 2.6,7.81 3.49,7.81 U1.7
$1N1882: length 18.1
  Top Layer w0.7: 13.08,7.87 12.83,7.62 9.28,7.62 9.27,7.62 NOREF#12.1
  Bottom Layer w0.7: 18.59,14.72 18.59,10.78 16.07,8.25 R3.2 14.54,7.72 14.35,7.72 14.24,7.61 NOREF#16.1 ; U1.3 NOREF#12.1
$1N1886: length 16.8
  Top Layer w0.7: NOREF#8.1 13.08,10.16
  Bottom Layer w0.7: NOREF.1 8.76,16.93 NOREF#8.1 U1.2 ; R2.2 14.69,10.15 NOREF#10.1
$1N1976: length 4.6
  Bottom Layer w0.7: 2.21,16.72 3.68,15.24 U1.5
$1N1978: length 2.5
  Bottom Layer w0.7: 2.21,25.39 U3.1

## Text on the board
Top Silkscreen Layer: GPIO0 | GPIO3 | GPIO2 | VCC | 3.3V | GND
